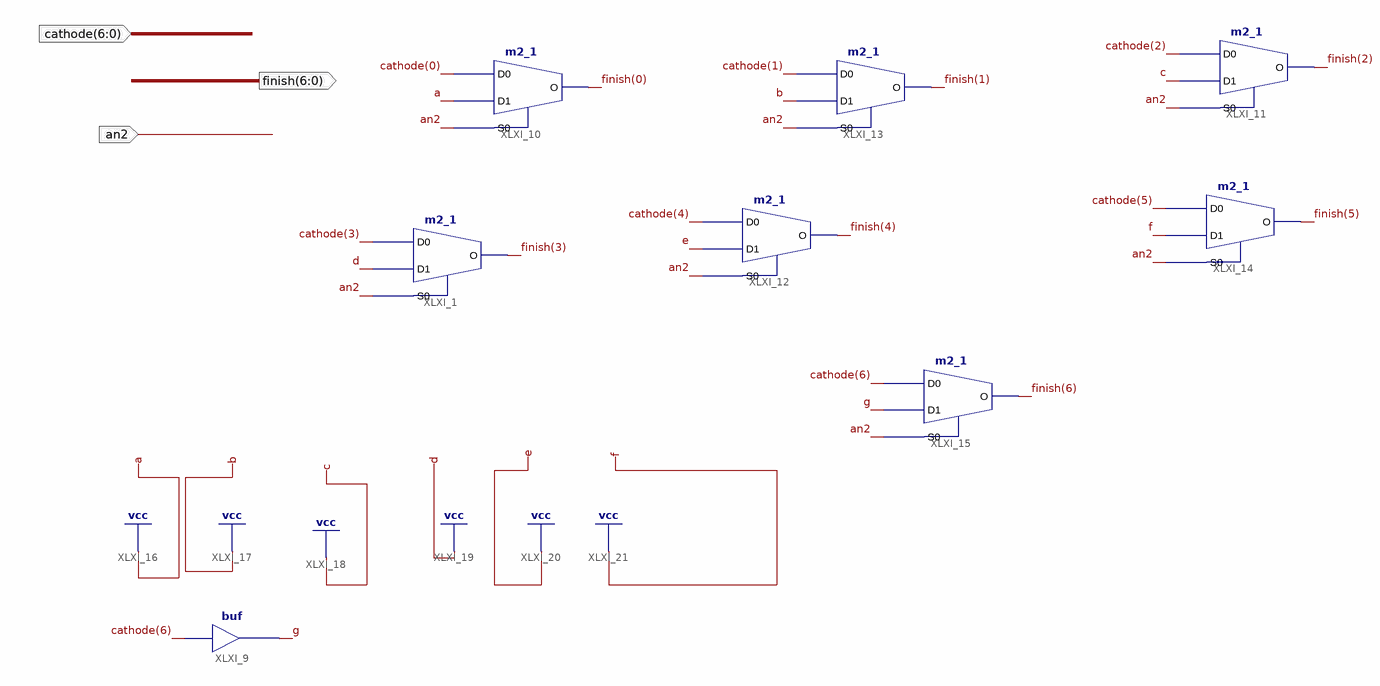
[diagram p0: schematic sheet 1]
// Xilinx ISE schematic negsign.sch (spartan3e) as structural Verilog: 8 symbols, 3 ports
module negsign (
  input  [6:0] cathode,
  input  an2,
  output [6:0] finish
);

  wire g;

  m2_1 XLXI_1 (.D0(cathode[3]), .D1(1'b1), .S0(an2), .O(finish[3]));
  buf XLXI_9 (g, cathode[6]);
  m2_1 XLXI_10 (.D0(cathode[0]), .D1(1'b1), .S0(an2), .O(finish[0]));
  m2_1 XLXI_11 (.D0(cathode[2]), .D1(1'b1), .S0(an2), .O(finish[2]));
  m2_1 XLXI_12 (.D0(cathode[4]), .D1(1'b1), .S0(an2), .O(finish[4]));
  m2_1 XLXI_13 (.D0(cathode[1]), .D1(1'b1), .S0(an2), .O(finish[1]));
  m2_1 XLXI_14 (.D0(cathode[5]), .D1(1'b1), .S0(an2), .O(finish[5]));
  m2_1 XLXI_15 (.D0(cathode[6]), .D1(g), .S0(an2), .O(finish[6]));
endmodule
